# EAGLE design war-in (EAGLE 6.6.0)
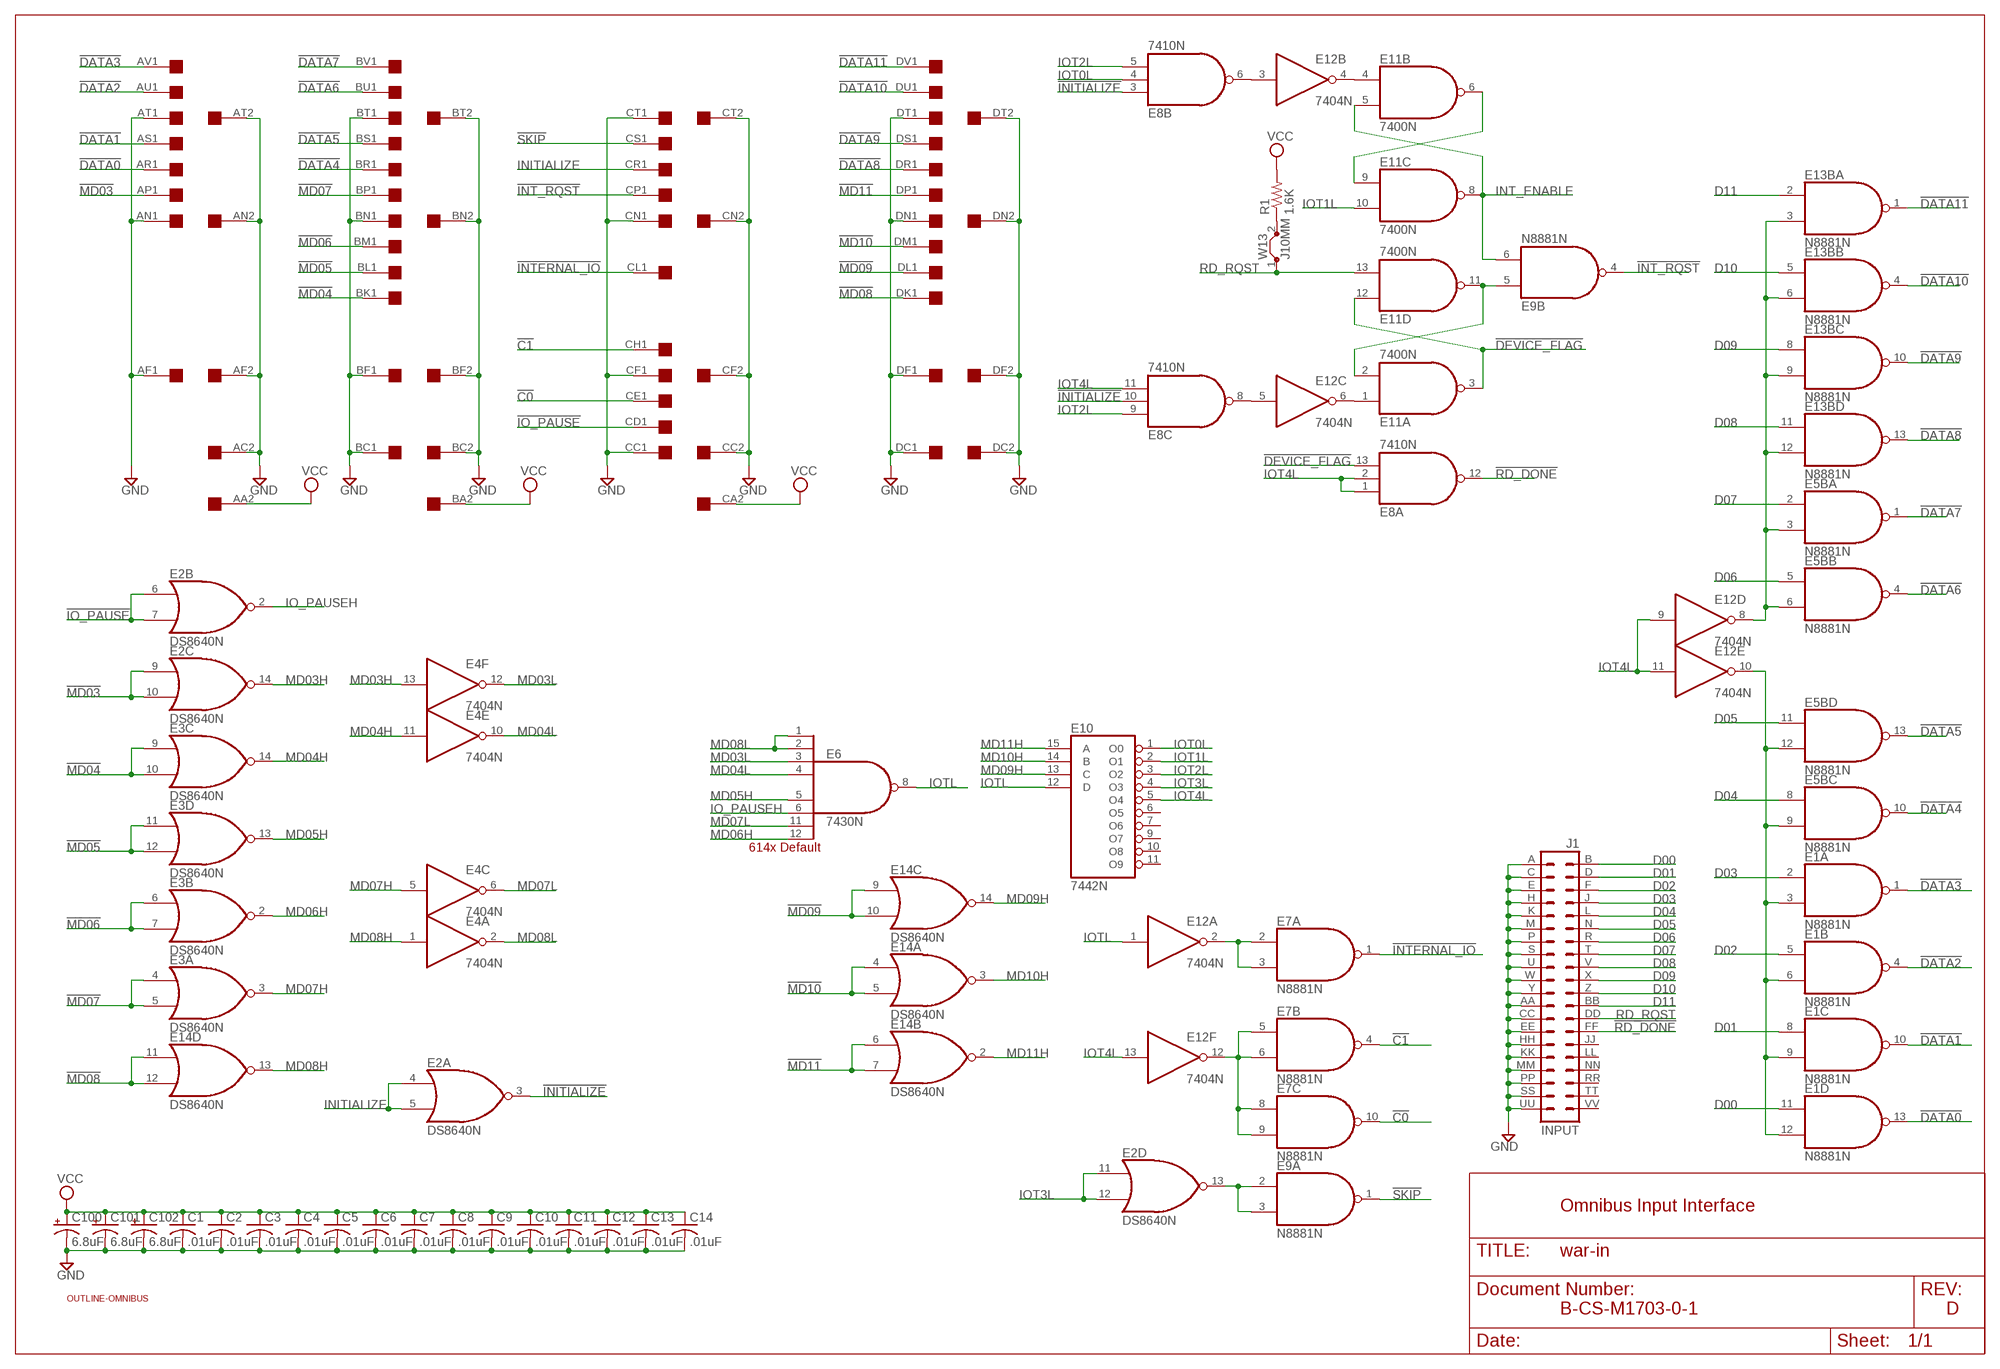
[diagram p0: schematic, sheet 1]

## Parts
C1  .01uF  C-US075-032X103  [C075-032X103]
C2  .01uF  C-US075-032X103  [C075-032X103]
C3  .01uF  C-US075-032X103  [C075-032X103]
C4  .01uF  C-US075-032X103  [C075-032X103]
C5  .01uF  C-US075-032X103  [C075-032X103]
C6  .01uF  C-US075-032X103  [C075-032X103]
C7  .01uF  C-US075-032X103  [C075-032X103]
C8  .01uF  C-US075-032X103  [C075-032X103]
C9  .01uF  C-US075-032X103  [C075-032X103]
C10  .01uF  C-US075-032X103  [C075-032X103]
C11  .01uF  C-US075-032X103  [C075-032X103]
C12  .01uF  C-US075-032X103  [C075-032X103]
C13  .01uF  C-US075-032X103  [C075-032X103]
C14  .01uF  C-US075-032X103  [C075-032X103]
C100  6.8uF  CPOL-USE20-8AXIAL  [E12-8]
C101  6.8uF  CPOL-USE20-8AXIAL  [E12-8]
C102  6.8uF  CPOL-USE20-8AXIAL  [E12-8]
E1  N8881N  [DIL14]
E2  DS8640N  [DIL14]
E3  DS8640N  [DIL14]
E4  7404N  [DIL14]
E5B  N8881N  [DIL14]
E6  7430N  [DIL14]
E7  N8881N  [DIL14]
E8  7410N  [DIL14]
E9  N8881N  [DIL14]
E10  7442N  74LS42N  [DIL16]
E11  7400N  [DIL14]
E12  7404N  [DIL14]
E13B  N8881N  [DIL14]
E14  DS8640N  [DIL14]
J1  INPUT  DEC40PINH  [DEC40PINH]
R1  1.6K  R-US_0207/10  [0207/10]
U$2  QUAD  [EDGE-CON8]
U$4  OUTLINE-OMNIBUS  [OMNIBUS]
W13  J10MM  [10]

## Nets
!C0: E7.10(C:O) U$2.CE1
!C1: E7.4(B:O) U$2.CH1
!DATA0: E1.13(D:O) U$2.AR1
!DATA1: E1.10(C:O) U$2.AS1
!DATA2: E1.4(B:O) U$2.AU1
!DATA3: E1.1(A:O) U$2.AV1
!DATA4: E5B.10(C:O) U$2.BR1
!DATA5: E5B.13(D:O) U$2.BS1
!DATA6: E5B.4(B:O) U$2.BU1
!DATA7: E5B.1(A:O) U$2.BV1
!DATA8: E13B.13(D:O) U$2.DR1
!DATA9: E13B.10(C:O) U$2.DS1
!DATA10: E13B.4(B:O) U$2.DU1
!DATA11: E13B.1(A:O) U$2.DV1
!DEVICE_FLAG: E8.13(A:I2) E11.3(A:O) E11.12(D:I0)
!INITIALIZE: E2.3(A:O) E8.3(B:I0) E8.10(C:I1)
!INT_ENABLE: E11.6(B:O) E11.9(C:I0)
!INT_RQST: E9.4(B:O) U$2.CP1
!INTERNAL_IO: E7.1(A:O) U$2.CL1
!IO_PAUSE: E2.6(B:I0) E2.7(B:I1) U$2.CD1
!MD03: E2.9(C:I0) E2.10(C:I1) U$2.AP1
!MD04: E3.9(C:I0) E3.10(C:I1) U$2.BK1
!MD05: E3.11(D:I0) E3.12(D:I1) U$2.BL1
!MD06: E3.6(B:I0) E3.7(B:I1) U$2.BM1
!MD07: E3.4(A:I0) E3.5(A:I1) U$2.BP1
!MD08: E14.11(D:I0) E14.12(D:I1) U$2.DK1
!MD09: E14.9(C:I0) E14.10(C:I1) U$2.DL1
!MD10: E14.4(A:I0) E14.5(A:I1) U$2.DM1
!MD11: E14.6(B:I0) E14.7(B:I1) U$2.DP1
!RD_DONE: E8.12(A:O) J1.FF
!SKIP: E9.1(A:O) U$2.CS1
D00: E1.11(D:I0) J1.B
D01: E1.8(C:I0) J1.D
D02: E1.5(B:I0) J1.F
D03: E1.2(A:I0) J1.J
D04: E5B.8(C:I0) J1.L
D05: E5B.11(D:I0) J1.N
D06: E5B.5(B:I0) J1.R
D07: E5B.2(A:I0) J1.T
D08: E13B.11(D:I0) J1.V
D09: E13B.8(C:I0) J1.X
D10: E13B.5(B:I0) J1.Z
D11: E13B.2(A:I0) J1.BB
DEVICE_FLAG: E9.5(B:I0) E11.2(A:I1) E11.11(D:O)
GND [Supply]: C1.2 C2.2 C3.2 C4.2 C5.2 C6.2 C7.2 C8.2 C9.2 C10.2 C11.2 C12.2 C13.2 C14.2 C100.- C101.- C102.- J1.A J1.AA J1.C J1.CC J1.E J1.EE J1.H J1.HH J1.K J1.KK J1.M J1.MM J1.P J1.PP J1.S J1.SS J1.U J1.UU J1.W J1.Y U$2.AC2 U$2.AF1 U$2.AF2 U$2.AN1 U$2.AN2 U$2.AT1 U$2.AT2 U$2.BC1 U$2.BC2 U$2.BF1 U$2.BF2 U$2.BN1 U$2.BN2 U$2.BT1 U$2.BT2 U$2.CC1 U$2.CC2 U$2.CF1 U$2.CF2 U$2.CN1 U$2.CN2 U$2.CT1 U$2.CT2 U$2.DC1 U$2.DC2 U$2.DF1 U$2.DF2 U$2.DN1 U$2.DN2 U$2.DT1 U$2.DT2
INITIALIZE: E2.4(A:I0) E2.5(A:I1) U$2.CR1
INT_ENABLE: E9.6(B:I1) E11.5(B:I1) E11.8(C:O)
IO_PAUSEH: E2.2(B:O) E6.6(I5)
IOT0L: E8.4(B:I1) E10.1(O0)
IOT1L: E10.2(O1) E11.10(C:I1)
IOT2L: E8.5(B:I2) E8.9(C:I0) E10.3(O2)
IOT3L: E2.11(D:I0) E2.12(D:I1) E10.4(O3)
IOT4L: E8.1(A:I0) E8.2(A:I1) E8.11(C:I2) E10.5(O4) E12.9(D:I) E12.11(E:I) E12.13(F:I)
IOTL: E6.8(O) E10.12(D) E12.1(A:I)
MD03H: E2.14(C:O) E4.13(F:I)
MD03L: E4.12(F:O) E6.3(I2)
MD04H: E3.14(C:O) E4.11(E:I)
MD04L: E4.10(E:O) E6.4(I3)
MD05H: E3.13(D:O) E6.5(I4)
MD06H: E3.2(B:O) E6.12(I7)
MD07H: E3.3(A:O) E4.5(C:I)
MD07L: E4.6(C:O) E6.11(I6)
MD08H: E4.1(A:I) E14.13(D:O)
MD08L: E4.2(A:O) E6.1(I0) E6.2(I1)
MD09H: E10.13(C) E14.14(C:O)
MD10H: E10.14(B) E14.3(A:O)
MD11H: E10.15(A) E14.2(B:O)
N$1: E1.3(A:I1) E1.6(B:I1) E1.9(C:I1) E1.12(D:I1) E5B.9(C:I1) E5B.12(D:I1) E12.10(E:O)
N$2: R1.1 W13.2
N$3: E5B.3(A:I1) E5B.6(B:I1) E12.8(D:O) E13B.3(A:I1) E13B.6(B:I1) E13B.9(C:I1) E13B.12(D:I1)
N$8: E11.4(B:I0) E12.4(B:O)
N$10: E2.13(D:O) E9.2(A:I0) E9.3(A:I1)
N$13: E8.6(B:O) E12.3(B:I)
N$24: E11.1(A:I0) E12.6(C:O)
N$26: E8.8(C:O) E12.5(C:I)
N$196: E7.2(A:I0) E7.3(A:I1) E12.2(A:O)
N$337: E7.5(B:I0) E7.6(B:I1) E7.8(C:I0) E7.9(C:I1) E12.12(F:O)
RD_RQST: E11.13(D:I1) J1.DD W13.1
VCC [Supply]: C1.1 C2.1 C3.1 C4.1 C5.1 C6.1 C7.1 C8.1 C9.1 C10.1 C11.1 C12.1 C13.1 C14.1 C100.+ C101.+ C102.+ R1.2 U$2.AA2 U$2.BA2 U$2.CA2
Unconnected: E4.3(B:I) E4.4(B:O) E4.8(D:O) E4.9(D:I) E7.11(D:I0) E7.12(D:I1) E7.13(D:O) E9.8(C:I0) E9.9(C:I1) E9.10(C:O) E9.11(D:I0) E9.12(D:I1) E9.13(D:O) E10.6(O5) E10.7(O6) E10.9(O7) E10.10(O8) E10.11(O9) J1.JJ J1.LL J1.NN J1.RR J1.TT J1.VV U$2.AA1 U$2.AB1 U$2.AB2 U$2.AC1 U$2.AD1 U$2.AD2 U$2.AE1 U$2.AE2 U$2.AH1 U$2.AH2 U$2.AJ1 U$2.AJ2 U$2.AK1 U$2.AK2 U$2.AL1 U$2.AL2 U$2.AM1 U$2.AM2 U$2.AP2 U$2.AR2 U$2.AS2 U$2.AU2 U$2.AV2 U$2.BA1 U$2.BB1 U$2.BB2 U$2.BD1 U$2.BD2 U$2.BE1 U$2.BE2 U$2.BH1 U$2.BH2 U$2.BJ1 U$2.BJ2 U$2.BK2 U$2.BL2 U$2.BM2 U$2.BP2 U$2.BR2 U$2.BS2 U$2.BU2 U$2.BV2 U$2.CA1 U$2.CB1 U$2.CB2 U$2.CD2 U$2.CE2 U$2.CH2 U$2.CJ1 U$2.CJ2 U$2.CK1 U$2.CK2 U$2.CL2 U$2.CM1 U$2.CM2 U$2.CP2 U$2.CR2 U$2.CS2 U$2.CU1 U$2.CU2 U$2.CV1 U$2.CV2 U$2.DA1 U$2.DA2 U$2.DB1 U$2.DB2 U$2.DD1 U$2.DD2 U$2.DE1 U$2.DE2 U$2.DH1 U$2.DH2 U$2.DJ1 U$2.DJ2 U$2.DK2 U$2.DL2 U$2.DM2 U$2.DP2 U$2.DR2 U$2.DS2 U$2.DU2 U$2.DV2

## Notes on the sheet
- 614x Default
- Omnibus Input Interface
- B-CS-M1703-0-1 | D

## Power pins joined to a net without a drawn wire
GND: E1.7(P:GND) E2.1(P:GND) E3.1(P:GND) E4.7(P:GND) E5B.7(P:GND) E6.7(GND) E7.7(P:GND) E8.7(P:GND) E9.7(P:GND) E10.8(GND) E11.7(P:GND) E12.7(P:GND) E13B.7(P:GND) E14.1(P:GND)
VCC: E1.14(P:VCC) E2.8(P:VCC) E3.8(P:VCC) E4.14(P:VCC) E5B.14(P:VCC) E6.14(VCC) E7.14(P:VCC) E8.14(P:VCC) E9.14(P:VCC) E10.16(VCC) E11.14(P:VCC) E12.14(P:VCC) E13B.14(P:VCC) E14.8(P:VCC)

## Library data of the parts
C1-C14 = rcl:C-US: CAPACITOR, American symbol
C100-C102 = dec-con:CPOL-USE20-8AXIAL: A 0.8 inch electrolytic.
E1 E5B E7 E9 E13B = dec-con:N8881: Quad 2-input NAND gate, open collector
E2 E3 E14 = dec-con:DS8640: Quad NOR gate
E4 E12 = 74xx-us:74*04: Hex INVERTER
E6 = 74xx-us:74*30: 8-input NAND gate
E8 = 74xx-us:74*10: Triple 3-input NAND gate
E10 = 74xx-us:74*42: 4-line to 10-line DECODER (1-of-10)
E11 = 74xx-us:74*00: Quad 2-input NAND gate
J1 = dec-con:DEC40PIN: PIN HEADER
R1 = rcl:R-US_: RESISTOR, American symbol
U$2 = dec-con:QUAD: Quad-Height DEC board
U$4 = dec-con:OUTLINE-*: Board outlines for DEC boards.
W13 = jumper:J: Bridge

## Net classes
1 Supply: width 0.813 mm

## Board
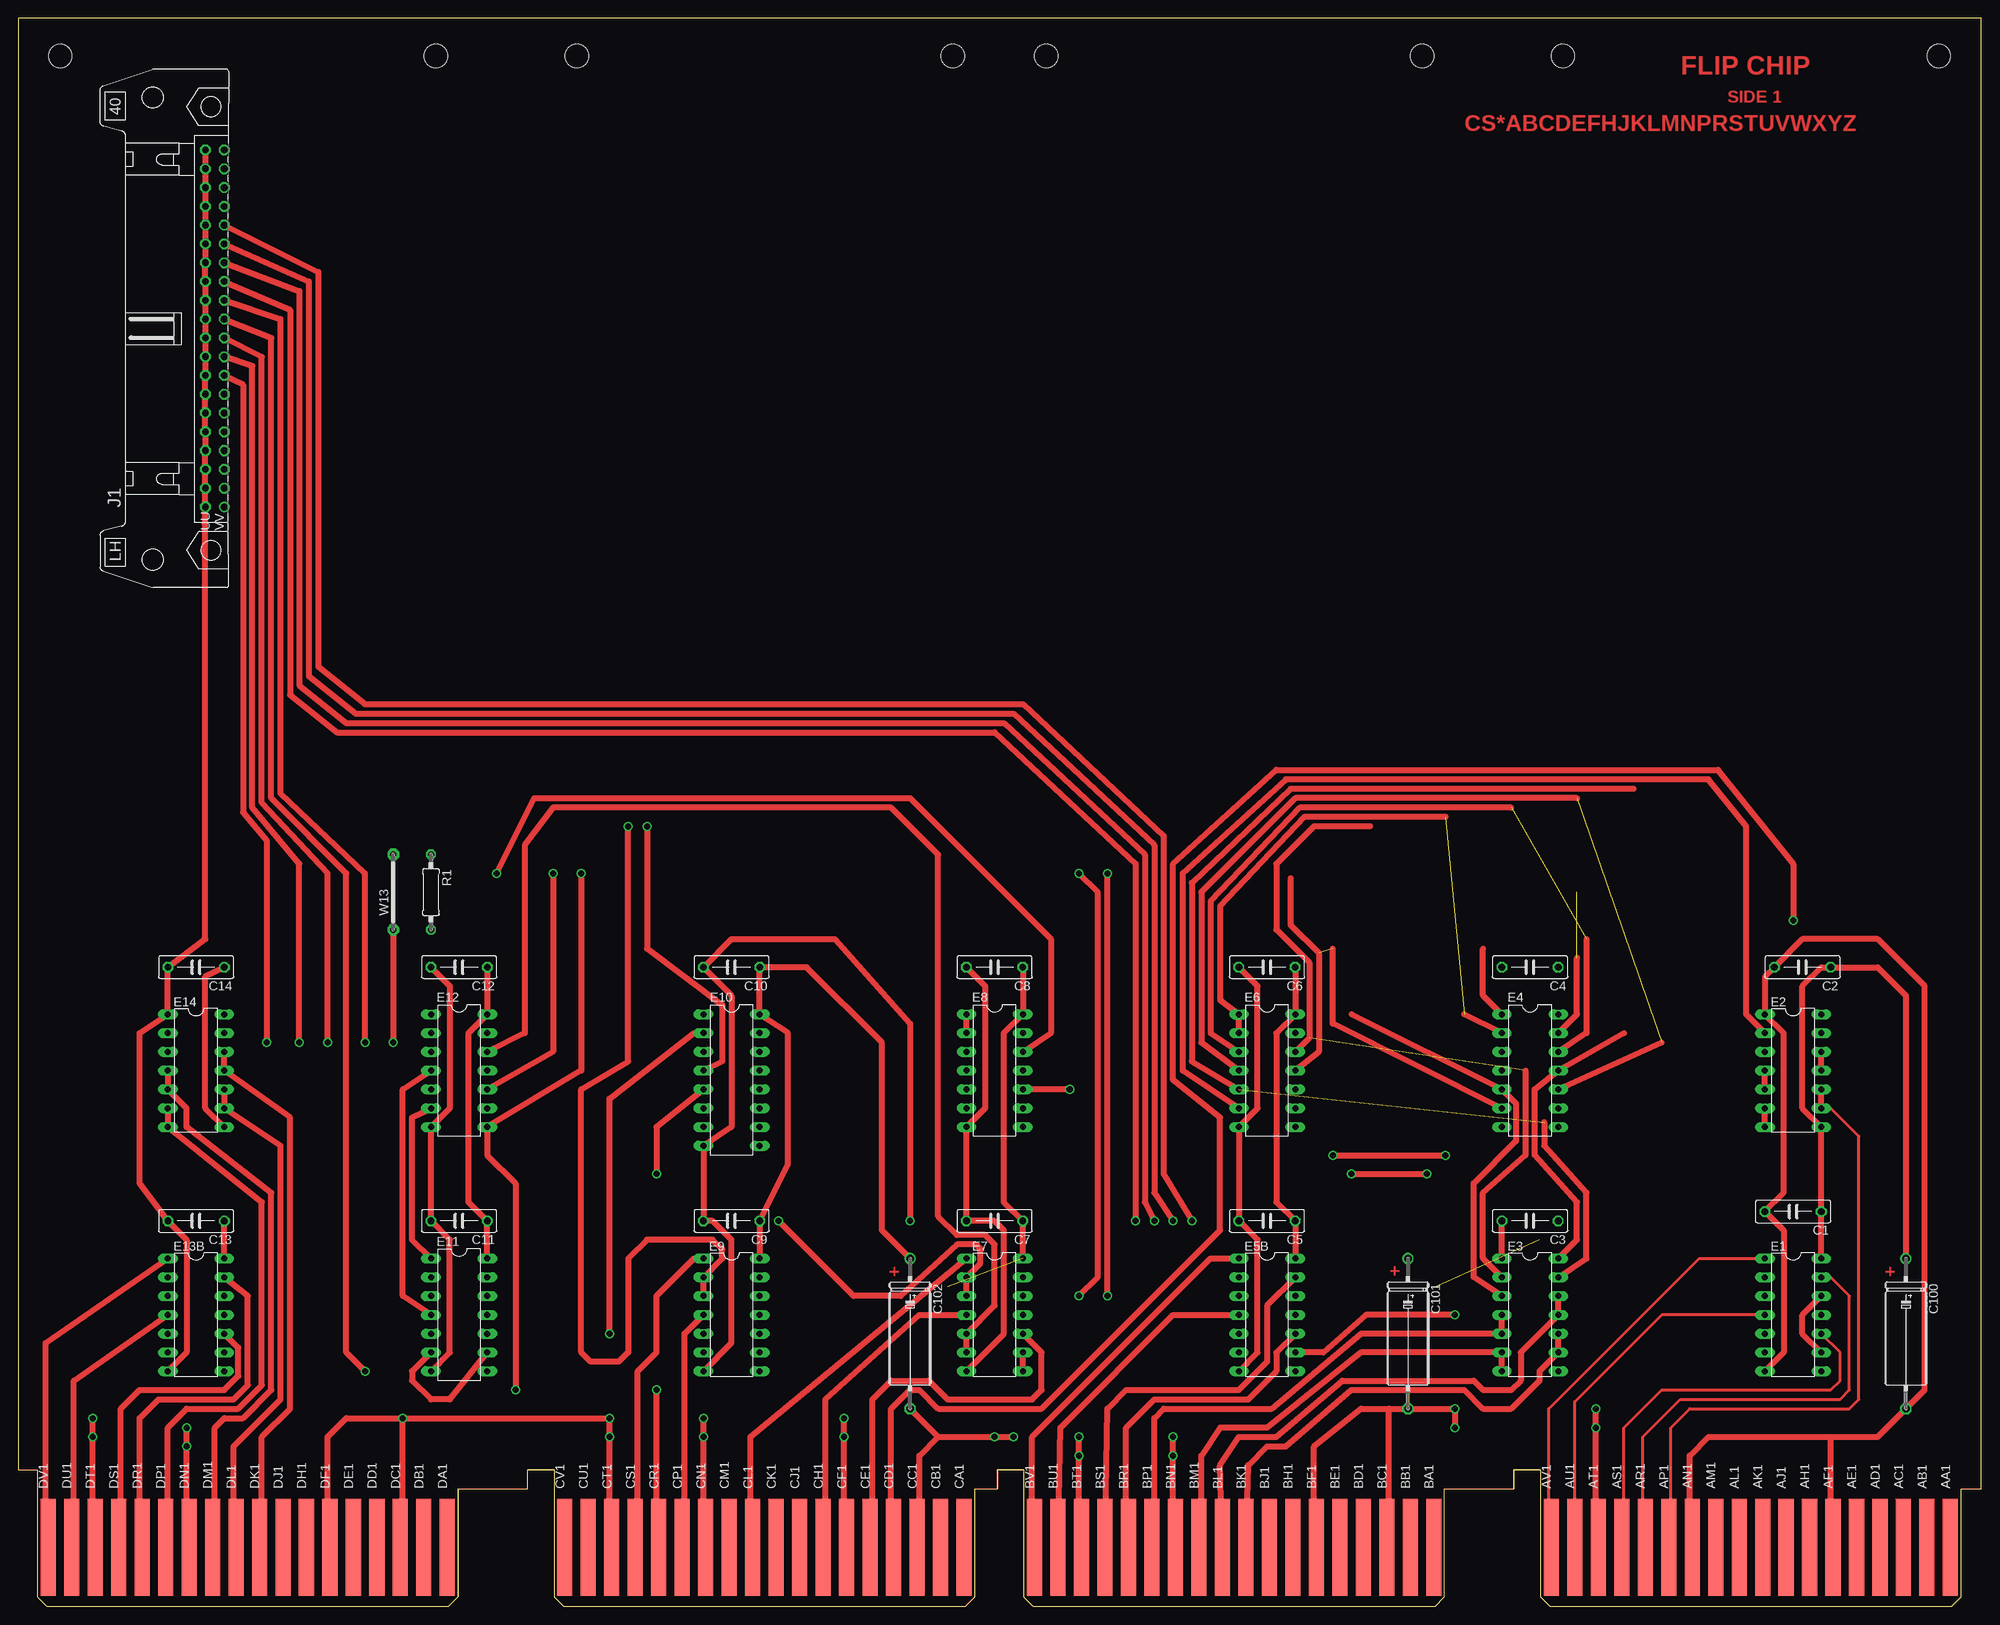
[diagram p1: board, top side]
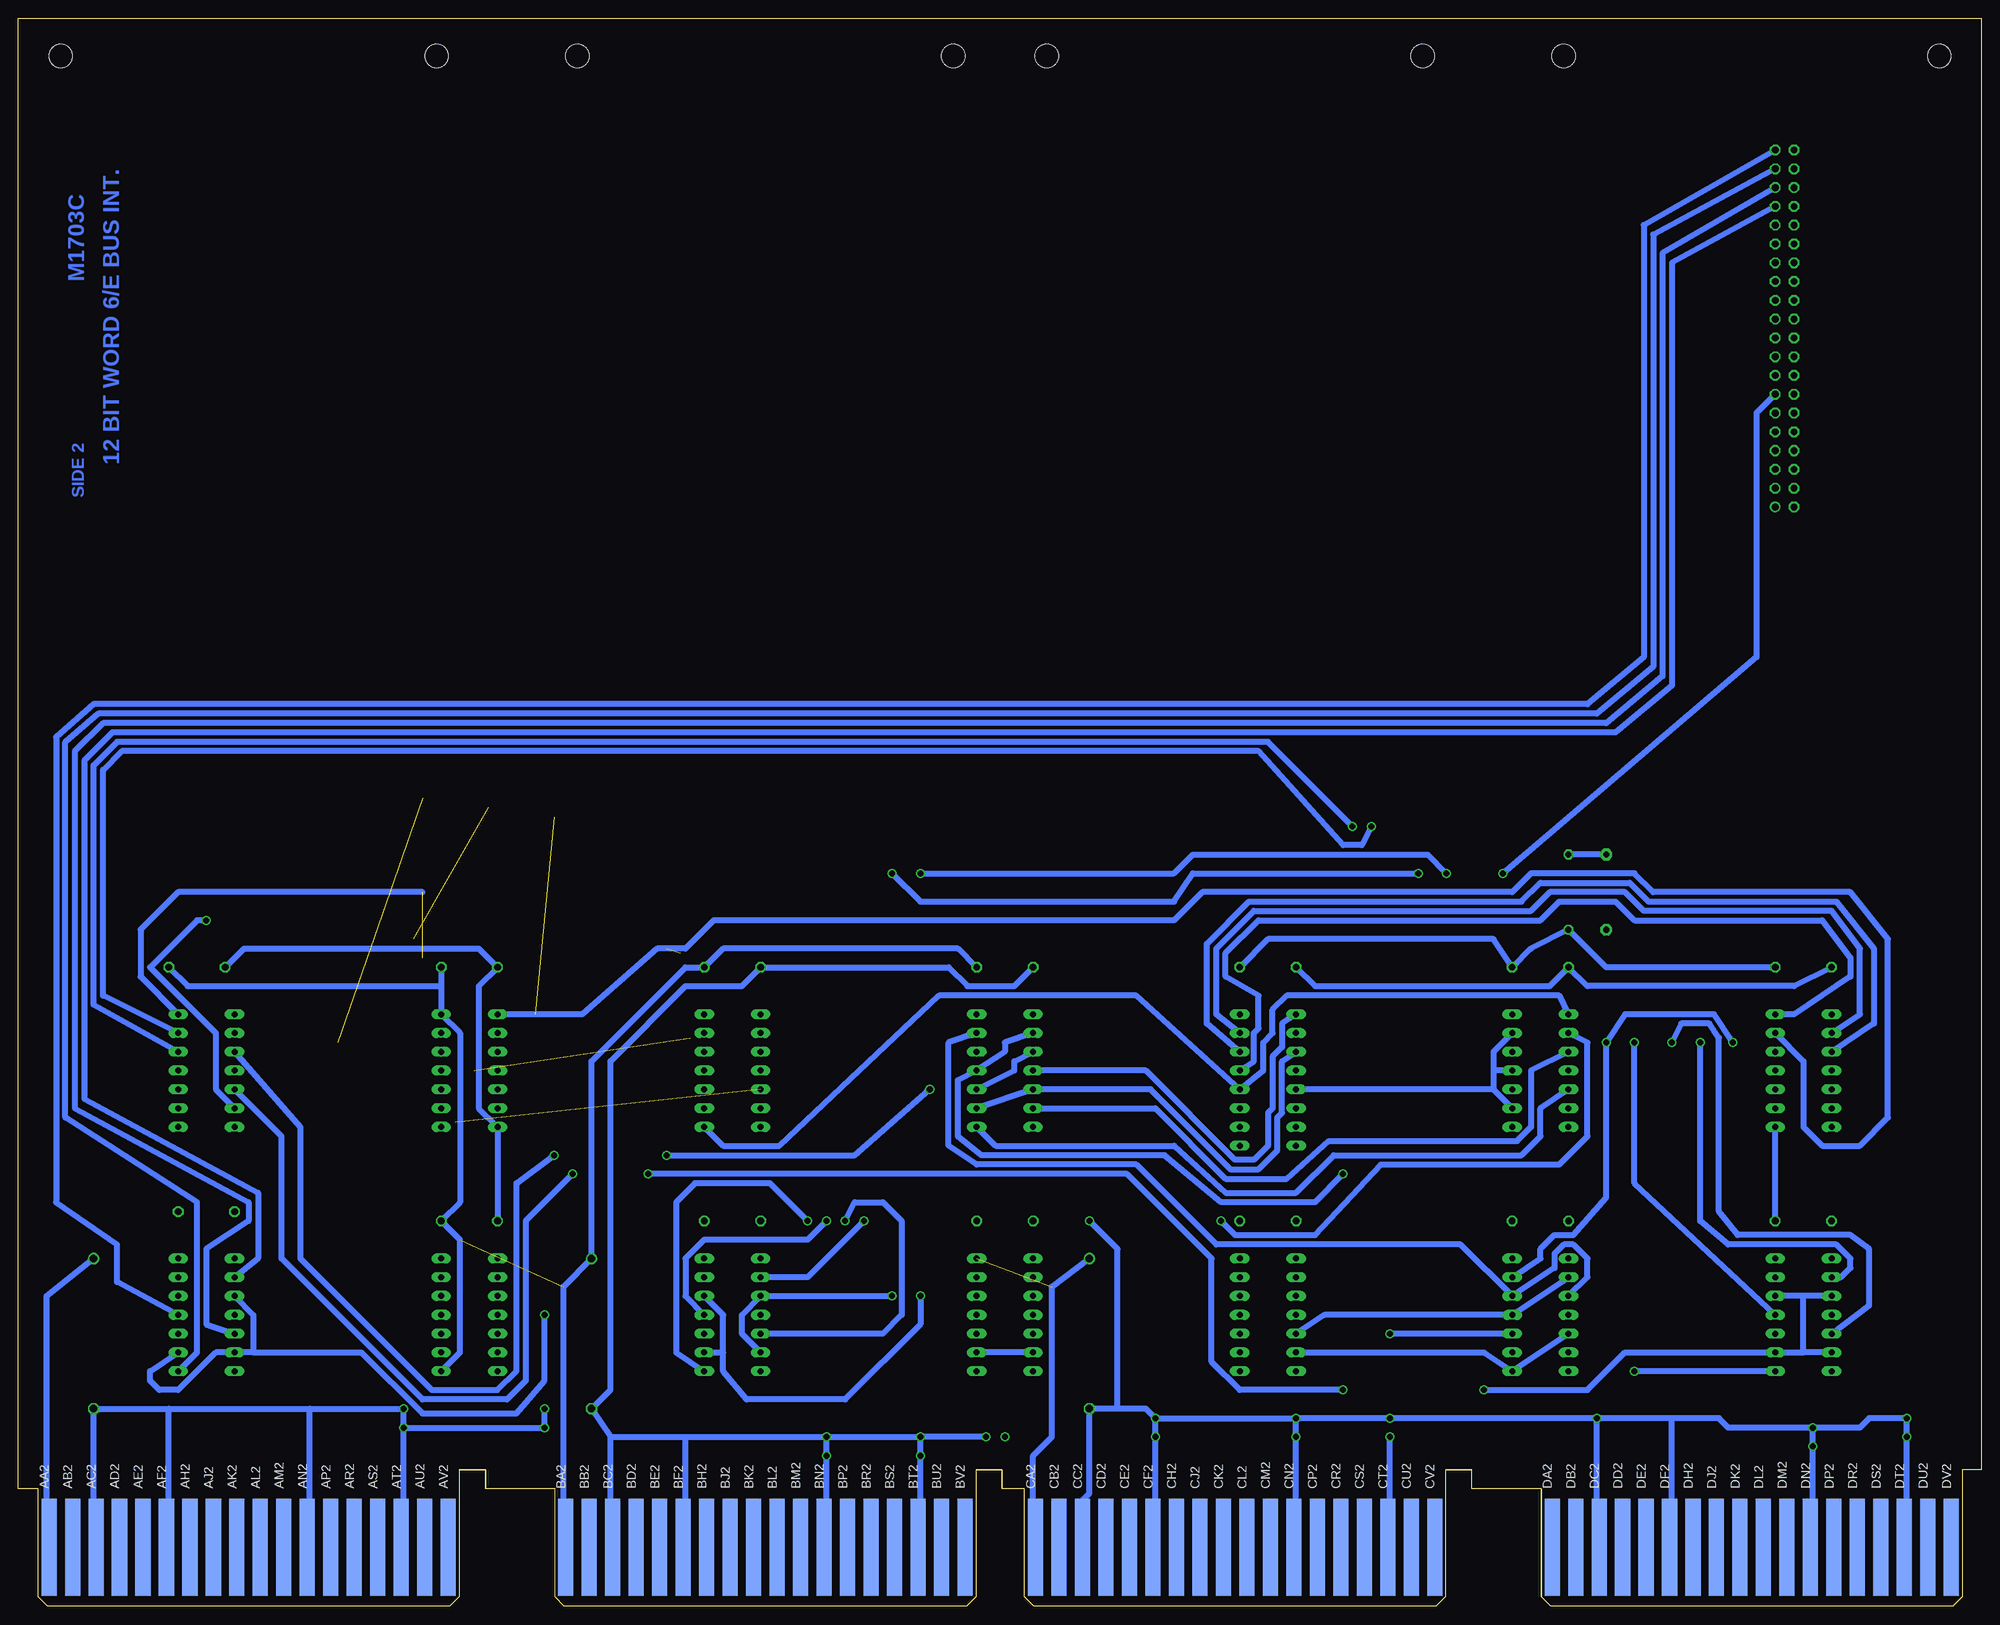
[diagram p2: board, bottom side, seen from below]

Size 265.3 x 214.63 mm. Coordinates in mm from the lower left corner, seen from the top.
Copper layers (1+16): Top 0.035mm / dielectric 1.5mm / Bottom 0.035mm
Design rules "16mils": minimum track width 16mil, minimum drill 32mil, track to track 15mil, track to pad 10mil, pad to pad 10mil, via to via 10mil, smd to smd 10mil, copper to edge 13mil, drill to drill 10mil, minimum pad ring 10mil, minimum via ring 8mil, stop-mask expansion 0mil, vias tented up to drill 0mil, thermal gap 10mil

### Footprints (pad centres in the part's own frame; a part is rotated, then mirrored left to right if it is on the bottom)
C075-032X103 = drill 0.914 octagon: 1 -3.81,0; 2 3.81,0
E12-8 = drill 1.016: + -10.16,0 | drill 1.016 octagon: - 10.16,0
DIL14 = drill 0.813 long: 1 -7.62,-3.81; 2 -5.08,-3.81; 3 -2.54,-3.81; 4 0,-3.81; 5 2.54,-3.81; 6 5.08,-3.81; 7 7.62,-3.81; 8 7.62,3.81; 9 5.08,3.81; 10 2.54,3.81; 11 0,3.81; 12 -2.54,3.81; 13 -5.08,3.81; 14 -7.62,3.81
DIL16 = drill 0.813 long: 1 -8.89,-3.81; 2 -6.35,-3.81; 3 -3.81,-3.81; 4 -1.27,-3.81; 5 1.27,-3.81; 6 3.81,-3.81; 7 6.35,-3.81; 8 8.89,-3.81; 9 8.89,3.81; 10 6.35,3.81; 11 3.81,3.81; 12 1.27,3.81; 13 -1.27,3.81; 14 -3.81,3.81; 15 -6.35,3.81; 16 -8.89,3.81
DEC40PINH = drill 0.914 octagon: A 24.13,1.27; AA -3.81,1.27; B 24.13,-1.27; BB -3.81,-1.27; C 21.59,1.27; CC -6.35,1.27; D 21.59,-1.27; DD -6.35,-1.27; E 19.05,1.27; EE -8.89,1.27; F 19.05,-1.27; FF -8.89,-1.27; H 16.51,1.27; HH -11.43,1.27; J 16.51,-1.27; JJ -11.43,-1.27; K 13.97,1.27; KK -13.97,1.27; L 13.97,-1.27; LL -13.97,-1.27; M 11.43,1.27; MM -16.51,1.27; N 11.43,-1.27; NN -16.51,-1.27; P 8.89,1.27; PP -19.05,1.27; R 8.89,-1.27; RR -19.05,-1.27; S 6.35,1.27; SS -21.59,1.27; T 6.35,-1.27; TT -21.59,-1.27; U 3.81,1.27; UU -24.13,1.27; V 3.81,-1.27; W 1.27,1.27; X 1.27,-1.27; Y -1.27,1.27; Z -1.27,-1.27 | drill 0.914: VV -24.13,-1.27
0207/10 = drill 0.813 octagon: 1 -5.08,0; 2 5.08,0
EDGE-CON8 = smd 2.032 x 13.106: AA1 261.303,7.938; AB1 258.127,7.938; AC1 254.952,7.938; AD1 251.778,7.938; AE1 248.602,7.938; AF1 245.428,7.938; AH1 242.252,7.938; AJ1 239.077,7.938; AK1 235.903,7.938; AL1 232.727,7.938; AM1 229.553,7.938; AN1 226.377,7.938; AP1 223.202,7.938; AR1 220.028,7.938; AS1 216.852,7.938; AT1 213.678,7.938; AU1 210.502,7.938; AV1 207.327,7.938; BA1 191.452,7.938; BB1 188.278,7.938; BC1 185.102,7.938; BD1 181.928,7.938; BE1 178.752,7.938; BF1 175.577,7.938; BH1 172.403,7.938; BJ1 169.227,7.938; BK1 166.053,7.938; BL1 162.877,7.938; BM1 159.702,7.938; BN1 156.528,7.938; BP1 153.352,7.938; BR1 150.178,7.938; BS1 147.002,7.938; BT1 143.827,7.938; BU1 140.653,7.938; BV1 137.477,7.938; CA1 127.953,7.938; CB1 124.778,7.938; CC1 121.603,7.938; CD1 118.427,7.938; CE1 115.252,7.938; CF1 112.078,7.938; CH1 108.903,7.938; CJ1 105.728,7.938; CK1 102.552,7.938; CL1 99.377,7.938; CM1 96.203,7.938; CN1 93.028,7.938; CP1 89.853,7.938; CR1 86.677,7.938; CS1 83.502,7.938; CT1 80.328,7.938; CU1 77.153,7.938; CV1 73.978,7.938; DA1 58.102,7.938; DB1 54.928,7.938; DC1 51.752,7.938; DD1 48.578,7.938; DE1 45.403,7.938; DF1 42.227,7.938; DH1 39.053,7.938; DJ1 35.877,7.938; DK1 32.703,7.938; DL1 29.527,7.938; DM1 26.352,7.938; DN1 23.177,7.938; DP1 20.003,7.938; DR1 16.828,7.938; DS1 13.652,7.938; DT1 10.477,7.938; DU1 7.303,7.938; DV1 4.128,7.938 | smd 2.032 x 13.106 bottom: AA2 261.303,7.938; AB2 258.127,7.938; AC2 254.952,7.938; AD2 251.778,7.938; AE2 248.602,7.938; AF2 245.428,7.938; AH2 242.252,7.938; AJ2 239.077,7.938; AK2 235.903,7.938; AL2 232.727,7.938; AM2 229.553,7.938; AN2 226.377,7.938; AP2 223.202,7.938; AR2 220.028,7.938; AS2 216.852,7.938; AT2 213.678,7.938; AU2 210.502,7.938; AV2 207.327,7.938; BA2 191.452,7.938; BB2 188.278,7.938; BC2 185.102,7.938; BD2 181.928,7.938; BE2 178.752,7.938; BF2 175.577,7.938; BH2 172.403,7.938; BJ2 169.227,7.938; BK2 166.053,7.938; BL2 162.877,7.938; BM2 159.702,7.938; BN2 156.528,7.938; BP2 153.352,7.938; BR2 150.178,7.938; BS2 147.002,7.938; BT2 143.827,7.938; BU2 140.653,7.938; BV2 137.477,7.938; CA2 127.953,7.938; CB2 124.778,7.938; CC2 121.603,7.938; CD2 118.427,7.938; CE2 115.252,7.938; CF2 112.078,7.938; CH2 108.903,7.938; CJ2 105.728,7.938; CK2 102.552,7.938; CL2 99.377,7.938; CM2 96.203,7.938; CN2 93.028,7.938; CP2 89.853,7.938; CR2 86.677,7.938; CS2 83.502,7.938; CT2 80.328,7.938; CU2 77.153,7.938; CV2 73.978,7.938; DA2 58.102,7.938; DB2 54.928,7.938; DC2 51.752,7.938; DD2 48.578,7.938; DE2 45.403,7.938; DF2 42.227,7.938; DH2 39.053,7.938; DJ2 35.877,7.938; DK2 32.703,7.938; DL2 29.527,7.938; DM2 26.352,7.938; DN2 23.177,7.938; DP2 20.003,7.938; DR2 16.828,7.938; DS2 13.652,7.938; DT2 10.477,7.938; DU2 7.303,7.938; DV2 4.128,7.938
OMNIBUS = hole 3.175: 208.915,209.55; 259.715,209.55; 189.865,209.55; 139.065,209.55; 75.616,209.55; 126.416,209.55; 56.566,209.55; 5.766,209.55
10 = drill 0.813 pad 1.6 octagon: 1 -5.08,0; 2 5.08,0

### Placement (x,y rotation side)
C1  239.9,53.34 180 top
C2  241.17,86.36 180 top
C3  204.34,52.07 180 top
C4  204.34,86.36 180 top
C5  168.78,52.07 180 top
C6  168.78,86.36 180 top
C7  131.95,52.07 180 top
C8  131.95,86.36 180 top
C9  96.39,52.07 180 top
C10  96.39,86.36 180 top
C11  59.56,52.07 180 top
C12  59.56,86.36 180 top
C13  24,52.07 180 top
C14  24,86.36 180 top
C100  255.14,36.83 270 top
C101  187.83,36.83 270 top
C102  120.52,36.83 270 top
E1  239.9,39.37 270 top
E2  239.9,72.39 270 top
E3  204.34,39.37 270 top
E4  204.34,72.39 270 top
E5B  168.78,39.37 270 top
E6  168.78,72.39 270 top
E7  131.95,39.37 270 top
E8  131.95,72.39 270 top
E9  96.39,39.37 270 top
E10  96.39,71.12 270 top
E11  59.56,39.37 270 top
E12  59.56,72.39 270 top
E13B  24,39.37 270 top
E14  24,72.39 270 top
J1  26.54,172.72 90 top
R1  55.75,96.52 270 top
U$2  -0.13,0 0 top
U$3  [FLIPCHIP]  205.61,212.09 270 top
U$4  -0.13,0 0 top
W13  50.67,96.52 90 top

### Tracks (layer width: path | path; a pad name or v marks a point on that pad's centre or on a via)
!C0
  Top 0.813: U$2.CE1 115.44,11.43 115.44,27.94 117.98,30.48 123.06,30.48 125.6,27.94 137.03,27.94 138.3,29.21 138.3,34.29 E7.10
!C1
  Top 0.813: U$2.CH1 109.09,10.16 109.09,27.94 121.79,39.37 E7.4
!DATA0
  Top 0.406: U$2.AR1 219.58,8.26 219.58,22.86 224.66,27.94 246.25,27.94 247.52,29.21 247.52,41.91 244.98,44.45 E1.13
!DATA1
  Top 0.406: U$2.AS1 217.04,8.26 217.04,24.13 222.12,29.21 244.98,29.21 246.25,30.48 246.25,34.29 E1.10
!DATA2
  Top 0.406: E1.4 222.12,39.37 210.38,27.62 U$2.AU1
!DATA3
  Top 0.406: U$2.AV1 206.88,7.94 206.88,26.67 227.2,46.99 E1.1
!DATA4
  Top 0.813: U$2.BR1 149.73,8.26 149.73,24.13 153.54,27.94 166.24,27.94 170.05,31.75 170.05,34.29 E5B.10
!DATA5
  Top 0.813: U$2.BS1 147.19,26.67 149.73,29.21 164.97,29.21 168.78,33.02 168.78,40.64 E5B.13
!DATA6
  Top 0.813: U$2.BU1 140.84,24.13 156.08,39.37 E5B.4
!DATA7
  Top 0.813: U$2.BV1 137.03,8.89 137.03,22.86 161.16,46.99 E5B.1
!DATA8
  Top 0.813: U$2.DR1 16.38,8.89 16.38,25.4 18.92,27.94 29.08,27.94 30.99,29.84 30.99,41.91 E13B.13
!DATA9
  Top 0.813: U$2.DS1 13.84,7.62 13.84,26.67 16.38,29.21 27.81,29.21 29.72,31.11 29.72,34.92 E13B.10
!DATA10
  Top 0.813: U$2.DU1 7.49,7.62 7.49,30.48 E13B.4
!DATA11
  Top 0.813: U$2.DV1 4,6.67 3.68,6.35 3.68,35.56 E13B.1
!DEVICE_FLAG
  Bottom 0.813: E11.3 53.21,44.45 53.21,46.99 55.12,48.9 56.39,48.9 57.66,47.62 57.66,45.72 E11.12 70.36,48.9 103.38,48.9 114.17,59.69 135.76,59.69 139.57,62.23 139.57,76.2 E8.13
!INITIALIZE  (via drill 0.81)
  Top 0.813: v177.67,60.96 v192.91,60.96 | v142.11,69.85 E8.10
  Bottom 0.813: v192.91,60.96 197.99,57.15 197.99,31.75 200.53,29.21 209.42,29.21 227.2,46.99 227.2,64.77 E2.3 | v177.67,60.96 152.27,60.96 v142.11,69.85 | E8.10 130.68,72.39 130.68,73.66 E8.3
!INT_ENABLE
  Top 0.813: E11.6 53.21,31.75 53.21,30.48 55.75,27.94 58.29,27.94 E11.9
!INT_RQST
  Top 0.813: U$2.CP1 90.04,8.26 90.04,36.83 E9.4
!INTERNAL_IO
  Top 0.813: U$2.CL1 98.93,8.89 98.93,22.86 E7.1
!IO_PAUSE  (via drill 0.81)
  Top 0.813: U$2.CD1 117.98,8.26 117.98,26.67 120.52,29.21 121.79,29.21 124.33,26.67 138.3,26.67 162.43,50.8 162.43,66.04 156.08,71.12 156.08,100.33 170.05,113.03 229.74,113.03 239.9,100.33 v239.9,92.71 | E2.7 E2.6
  Bottom 0.813: v239.9,92.71 241.17,92.71 247.52,86.36 238.63,77.47 238.63,69.85 E2.6
!MD03
  Top 0.406: U$2.AP1 223.39,8.26 223.39,24.13 225.93,26.67 247.52,26.67 248.79,27.94 248.79,63.5 244.98,67.31 E2.9
  Top 0.813: E2.9 E2.10
!MD04
  Top 0.813: U$2.BK1 166.24,19.05 168.78,21.59 171.32,21.59 180.21,29.21 195.45,29.21 197.99,26.67 201.8,26.67 205.61,30.48 205.61,31.75 E3.9 E3.10
!MD05
  Top 0.813: U$2.BL1 162.43,19.05 164.97,22.86 170.05,22.86 178.94,30.48 196.72,30.48 197.99,29.21 201.8,29.21 203.07,30.48 203.07,34.29 E3.11 E3.12
!MD06
  Top 0.813: U$2.BM1 159.89,7.62 159.89,20.32 162.43,24.13 168.78,24.13 181.48,34.29 E3.6 E3.7
!MD07
  Top 0.813: U$2.BP1 153.54,8.89 153.54,25.4 154.81,26.67 169.42,26.67 181.48,36.83 E3.5 E3.4
!MD08
  Top 0.813: U$2.DK1 32.89,8.89 32.89,22.86 36.7,26.67 36.7,66.04 E14.11 E14.12
!MD09
  Top 0.813: E14.10 E14.9 35.43,62.23 35.43,27.94 29.08,21.59 29.08,7.62 U$2.DL1
!MD10
  Top 0.813: E14.4 E14.5 22.73,67.31 22.73,64.77 34.16,55.88 34.16,29.21 30.35,25.4 27.81,25.4 26.54,24.13 26.54,8.89 U$2.DM1
!MD11
  Top 0.813: U$2.DP1 20.19,8.89 20.19,24.13 22.73,26.67 29.72,26.67 32.89,29.84 32.89,54.61 E14.7 E14.6
!RD_DONE  (via drill 0.81)
  Top 0.813: v64.64,99.06 69.72,109.22 120.52,109.22 139.57,90.17 139.57,77.47 E8.12
  Bottom 0.813: J1.FF 30.35,161.29 30.35,128.27 v64.64,99.06
!SKIP
  Top 0.813: U$2.CS1 83.69,8.26 83.69,31.75 86.23,34.29 86.23,41.91 91.31,46.99 E9.1
D00
  Bottom 0.813: J1.B 45.59,186.69 45.59,128.27 53.21,121.92 255.14,121.92 260.22,117.47 260.22,54.61 251.97,48.9 251.97,43.81 E1.11
D01
  Bottom 0.813: E1.8 241.17,34.29 241.17,54.61 258.95,66.04 258.95,116.84 254.51,120.65 51.94,120.65 44.32,127 44.32,185.42 J1.D
D02
  Bottom 0.813: J1.F 43.05,182.88 43.05,125.73 50.67,119.38 253.87,119.38 257.68,115.57 257.68,67.31 234.19,54.61 234.19,52.07 239.9,48.26 239.9,38.1 E1.5
D03
  Bottom 0.813: J1.J 41.78,181.61 41.78,124.46 49.4,118.11 252.6,118.11 256.41,114.3 256.41,68.58 232.92,55.88 232.92,46.99 E1.2
D04  (via drill 0.81)
  Top 0.813: J1.L 40.51,180.34 40.51,127 46.86,121.92 135.76,121.92 154.81,104.14 154.81,58.42 v158.62,52.07
  Bottom 0.813: v158.62,52.07 163.7,57.15 173.86,57.15 176.4,54.61 176.4,34.29 E5B.8
D05  (via drill 0.81)
  Top 0.813: J1.N 39.24,179.07 39.24,125.73 45.59,120.65 134.49,120.65 153.54,102.87 153.54,55.88 v156.08,52.07
  Bottom 0.813: v156.08,52.07 158.62,49.53 172.59,49.53 175.13,46.99 175.13,41.91 E5B.11
D06  (via drill 0.81)
  Top 0.813: J1.R 37.97,177.8 37.97,124.46 44.32,119.38 133.22,119.38 152.27,101.6 152.27,54.61 v153.54,52.07
  Bottom 0.813: v153.54,52.07 152.27,54.61 148.46,54.61 145.92,52.07 145.92,39.37 148.46,36.83 E5B.5
D07  (via drill 0.81)
  Top 0.813: J1.T 36.7,175.26 36.7,123.19 43.05,118.11 131.95,118.11 151,100.33 v151,52.07
  Bottom 0.813: v151,52.07 158.62,44.45 E5B.2
D08  (via drill 0.81)
  Top 0.813: v46.86,76.2 46.86,99.06 35.43,109.86 35.43,173.99 J1.V
  Bottom 0.813: E13B.11 46.86,57.15 v46.86,76.2
D09  (via drill 0.81)
  Top 0.813: v46.86,31.75 44.32,34.29 44.32,99.06 34.16,109.22 34.16,171.45 J1.X
  Bottom 0.813: E13B.8 v46.86,31.75
D10  (via drill 0.81)
  Top 0.813: v41.78,76.2 41.78,99.06 32.89,108.58 32.89,168.91 J1.Z
  Bottom 0.813: E13B.5 15.11,40.64 15.11,48.26 17.65,50.16 32.89,50.16 35.43,53.34 35.43,76.83 36.7,78.74 40.51,78.74 v41.78,76.2
D11  (via drill 0.81)
  Top 0.813: v37.97,76.2 37.97,100.33 31.62,107.95 31.62,167.64 J1.BB
  Bottom 0.813: E13B.2 18.92,44.45 17.65,45.72 17.65,46.99 19.56,48.9 34.16,48.9 37.97,52.07 v37.97,76.2
DEVICE_FLAG
  Bottom 0.813: E9.5 88.77,39.37 E11.11 E11.2
GND  (via drill 0.81)
  Top 0.813: U$2.AT2 213.23,8.26 v213.23,24.13 v213.23,26.67 | U$2.AN2 225.93,8.26 225.93,20.32 228.47,22.86 244.98,22.86 | 244.98,22.86 251.33,22.86 C100.- 257.68,29.21 257.68,83.82 251.33,90.17 241.17,90.17 C2.2 236.09,85.09 E2.1 238.63,77.47 238.63,55.88 C1.2 238.63,50.8 238.63,34.29 E1.7 | U$2.AF2 244.98,8.26 244.98,22.86 | U$2.DF2 41.78,8.26 41.78,22.86 44.32,25.4 v51.94,25.4 | v51.94,25.4 v79.88,25.4 v79.88,22.86 79.88,8.26 U$2.CT2 | U$2.DC2 51.94,8.26 v51.94,25.4 | v92.58,25.4 v92.58,22.86 92.58,8.89 U$2.CN2 | U$2.CF2 111.63,8.26 v111.63,22.86 v111.63,25.4 | U$2.CC2 121.79,8.26 121.79,20.32 124.33,22.86 | 124.33,22.86 C102.- | 124.33,22.86 v131.95,22.86 v134.49,22.86 | U$2.BT2 143.38,8.26 v143.38,20.32 v143.38,22.86 | U$2.BN2 156.08,8.26 v156.08,20.32 v156.08,22.86 | U$2.BF2 175.13,8.89 175.13,21.59 181.48,26.67 185.29,26.67 | 185.29,26.67 C101.- v194.18,26.67 v194.18,24.13 | U$2.BC1 185.29,8.89 185.29,26.67 | E3.1 C3.2 | E5B.7 167.51,34.29 167.51,49.53 C5.2 E6.7 167.51,67.31 167.51,83.82 C6.2 | C8.2 130.68,83.82 130.68,67.31 E8.7 C7.2 131.95,52.07 133.22,50.8 133.22,36.83 E7.7 | J1.A J1.C J1.E J1.H J1.K J1.M J1.P J1.S J1.U J1.W J1.Y J1.AA J1.CC J1.EE J1.HH J1.KK J1.MM J1.PP J1.SS J1.UU 25.27,90.17 C14.2 E14.1 16.38,77.47 16.38,57.15 C13.2 22.73,49.53 22.73,34.29 E13B.7 | U$2.DT2 10.03,8.89 v10.03,22.86 v10.03,25.4 | U$2.DN2 22.73,8.89 v22.73,21.59 v22.73,24.13 | E11.7 58.29,34.29 58.29,49.53 C11.2 E12.7 58.29,67.31 58.29,83.82 C12.2 | v120.52,52.07 120.52,78.74 110.36,90.17 96.39,90.17 C10.2 96.39,82.55 96.39,64.77 E10.8 C9.2 93.85,52.07 96.39,49.53 96.39,35.56 E9.7
  Bottom 0.813: 213.23,8.89 213.23,8.26 U$2.AT2 213.23,8.89 | 213.23,8.89 v213.23,24.13 | v134.49,22.86 v143.38,22.86 | v156.08,22.86 v143.38,22.86 | U$2.BT2 143.38,8.89 v143.38,22.86 | U$2.BN2 156.08,8.89 v156.08,22.86 | U$2.BF2 175.13,8.89 175.13,22.86 | 175.13,22.86 v156.08,22.86 | U$2.BC1 185.29,10.16 185.29,22.86 | 185.29,22.86 175.13,22.86 | 185.29,22.86 C101.- 185.29,29.21 185.29,73.66 175.13,83.82 167.51,83.82 C6.2 139.57,86.36 137.03,83.82 130.68,83.82 C8.2 | v213.23,24.13 v194.18,24.13 v194.18,26.67 | v213.23,24.13 v213.23,26.67 225.93,26.67 | U$2.AC2 255.14,8.89 C100.- 244.98,26.67 | 244.98,26.67 225.93,26.67 | U$2.AF2 244.98,8.89 244.98,26.67 | U$2.AN2 225.93,10.16 225.93,26.67 | C2.2 234.82,88.9 203.07,88.9 C4.2 203.07,83.82 203.07,67.31 E4.7 C3.2 | U$2.DT2 10.03,10.16 v10.03,22.86 v10.03,25.4 15.11,25.4 16.38,24.13 v22.73,24.13 | U$2.DN2 22.73,8.89 v22.73,21.59 v22.73,24.13 | v22.73,24.13 34.16,24.13 35.43,25.4 41.78,25.4 | 41.78,25.4 v51.94,25.4 | U$2.DF2 41.78,8.89 41.78,25.4 | U$2.DC2 51.94,8.89 v51.94,25.4 | v51.94,25.4 v79.88,25.4 v92.58,25.4 | U$2.CT2 79.88,8.89 v79.88,22.86 | 92.58,8.26 92.58,8.89 | 92.58,8.89 v92.58,25.4 | U$2.CN2 92.58,8.89 | U$2.CF2 111.63,8.89 v111.63,25.4 | v111.63,25.4 v92.58,25.4 | v111.63,25.4 112.9,26.67 116.71,26.67 | 116.71,26.67 C102.- 120.52,15.24 121.48,14.29 U$2.CC2 | 116.71,26.67 116.71,48.26 v120.52,52.07 | C14.2 25.27,83.82 53.21,83.82 C12.2 58.29,83.82 90.04,83.82 C10.2
INITIALIZE  (via drill 0.81)
  Top 0.406: U$2.CR1 86.23,8.26
  Top 0.813: 86.23,8.26 v86.23,29.21 | v180.21,58.42 v190.37,58.42 | E2.5 E2.4
  Bottom 0.813: v86.23,29.21 100.2,29.21 104.01,33.02 104.01,46.99 115.44,58.42 v180.21,58.42 | v190.37,58.42 196.72,52.07 196.72,30.48 199.26,27.94 210.69,27.94 229.74,46.99 229.74,63.5 E2.5
INT_ENABLE
  Bottom 0.813: E9.6 67.18,34.29 E11.8 E11.5
IO_PAUSEH
  Top 0.813: E2.2 233.55,80.01 233.55,105.41 228.47,111.76 171.32,111.76 157.35,99.06 157.35,72.39 E6.6
IOT0L
  Bottom 0.813: E10.1 94.49,78.74 94.49,75.56 95.76,74.3 95.76,67.31 96.39,66.67 96.39,62.23 98.3,60.33 100.84,60.33 112.9,72.39 E8.4
IOT1L  (via drill 0.81)
  Top 0.813: v79.88,36.83 79.88,68.58 91.31,77.47 E10.2
  Bottom 0.813: E11.10 v79.88,36.83
IOT2L
  Bottom 0.813: E10.3 94.49,73.66 94.49,66.67 95.12,66.04 95.12,61.59 97.66,59.05 101.47,59.05 112.27,69.85 E8.5 E8.9
IOT3L  (via drill 0.81)
  Top 0.813: E2.11 E2.12 | v84.96,105.41 84.96,88.9 95.12,81.28 95.12,73.66 E10.4
  Bottom 0.813: v84.96,105.41 96.39,116.84 251.97,116.84 255.14,113.67 255.14,81.28 E2.12
IOT4L  (via drill 0.81)
  Top 0.813: E10.5 86.23,64.77 v86.23,58.42 | E8.2 E8.1
  Bottom 0.813: E12.13 65.91,74.93 65.91,72.39 | 65.91,72.39 65.91,69.85 | 65.91,69.85 E12.9 | E12.11 65.91,72.39 | 65.91,69.85 E10.5 | v86.23,58.42 90.04,54.61 102.74,54.61 110.36,60.96 135.13,60.96 138.3,63.5 138.3,71.12 E8.11 131.95,74.93 131.95,76.2 E8.2
IOTL
  Bottom 0.813: E12.1 57.02,82.55 93.85,82.55 95.76,80.64 95.76,77.47 97.03,76.2 97.03,72.39 E10.12 114.17,82.55 140.84,82.55 162.43,62.23 170.05,62.23 E6.8
MD03H  (1 unrouted)
  Top 0.813: E4.13 210.69,80.01 210.69,87.63
  Bottom 0.813: 210.69,96.52 243.71,96.52 248.79,91.44 248.79,85.09 E2.14
MD03L  (1 unrouted)
  Top 0.813: 211.96,90.17 211.96,77.47 E4.12 | 201.8,107.95 173.23,107.95 161.16,95.25 161.16,77.47 E6.3
MD04H
  Top 0.813: E3.14 210.69,49.53 210.69,54.61 204.98,60.96 204.98,69.85 E4.11 217.04,77.47
MD04L  (1 unrouted)
  Top 0.813: E4.10 222.12,76.2 | 210.69,109.22 172.59,109.22 159.89,96.52 159.89,76.2 E6.4
MD05H  (1 unrouted)
  Top 0.813: E3.13 211.96,46.99 211.96,55.88 206.25,62.23 206.25,65.41 | 218.31,110.49 171.96,110.49 158.62,97.79 158.62,73.66 E6.5
MD06H  (1 unrouted)
  Top 0.813: E3.2 197.99,46.99 197.99,55.88 203.71,60.96 203.71,72.39 | 182.75,105.41 175.13,105.41 170.05,100.33 170.05,91.44 174.5,87 174.5,76.83 E6.12
MD07H
  Top 0.813: E3.3 196.72,44.45 196.72,57.15 202.44,62.87 202.44,67.94 E4.5 180.21,80.01
MD07L  (1 unrouted)
  Top 0.813: 177.67,88.9 177.67,78.74 E4.6 | 171.96,98.42 171.96,92.08 175.77,88.27 175.77,74.93 E6.11
MD08H
  Top 0.813: E4.1 197.99,82.55 197.99,88.9
  Bottom 0.813: E14.13 24,73.66 24,64.77 21.46,62.23 16.38,62.23 12.57,66.04 12.57,90.17 17.65,96.52 44.32,96.52 46.86,99.06 60.83,99.06 63.37,96.52 105.28,96.52 109.09,92.71 171.32,92.71 175.13,88.9 178.94,88.9 189.1,80.01 E4.1
MD08L  (1 unrouted)
  Top 0.813: E4.2 195.45,80.01 | 192.91,106.68 173.86,106.68 162.43,94.61 162.43,81.92 E6.1 E6.2
MD09H
  Bottom 0.813: E10.13 98.3,73.66 98.3,77.47 97.66,78.11 97.66,82.55 102.11,85.09 102.11,88.27 97.66,92.71 59.56,92.71 57.02,95.25 49.4,95.25 46.86,92.71 21.46,92.71 17.65,87.63 17.65,85.09 25.27,80.01 E14.14
MD10H
  Bottom 0.813: E10.14 104.65,78.74 104.65,89.53 98.93,95.25 62.1,95.25 59.56,97.79 47.5,97.79 44.96,95.25 19.56,95.25 14.48,88.9 14.48,78.74 E14.3
MD11H
  Bottom 0.813: E10.15 103.38,80.01 103.38,88.9 98.3,93.98 60.83,93.98 58.29,96.52 48.13,96.52 45.59,93.98 20.19,93.98 16.38,88.9 16.38,80.01 E14.2
N$1  (via drill 0.81)
  Top 0.813: v194.18,39.37 182.12,39.37 176.4,34.29 E5B.9 | E1.9 241.17,36.83 241.17,39.37 E1.12 | v72.26,99.06 72.26,74.93 E12.10 | v143.38,41.91 145.92,44.45 145.92,96.52 v143.38,99.06
  Bottom 0.813: E1.9 247.52,31.75 247.52,30.48 246.25,29.21 243.71,29.21 238.63,34.29 E1.6 233.55,34.29 | E1.3 233.55,39.37 233.55,34.29 | 233.55,34.29 218.95,34.29 210.69,26.04 197.99,26.04 194.18,30.48 v194.18,39.37 | v143.38,99.06 109.09,99.06 106.55,101.6 74.8,101.6 v72.26,99.06 | v143.38,41.91 143.38,38.1 153.54,27.94 166.88,27.94 170.05,31.75 170.05,34.29 | 170.05,34.29 170.05,39.37 E5B.12 | E5B.9 170.05,34.29
N$2
  Bottom 0.813: W13.2 R1.1
N$3  (via drill 0.81)
  Top 0.813: v76.07,99.06 76.07,72.39 E12.8 63.37,60.96 67.18,57.15 v67.18,29.21 | v147.19,41.91 v147.19,99.06
  Bottom 0.813: E13B.3 24,41.91 | 24,41.91 E13B.12 | 24,34.29 E13B.9 48.13,34.29 53.21,29.21 v67.18,29.21 | E13B.6 24,34.29 | 24,34.29 24,41.91 | E5B.6 167.51,36.83 167.51,39.37 E5B.3 v147.19,41.91 | v147.19,99.06 143.38,95.25 109.09,95.25 106.55,99.06 v76.07,99.06
N$8
  Top 0.813: E11.4 51.94,41.91 51.94,69.85 E12.4
N$10  (via drill 0.81)
  Top 0.813: E9.3 E9.2 95.12,46.99 95.12,48.26 93.85,49.53 84.96,49.53 82.42,46.99 82.42,34.29 81.15,33.02 77.34,33.02 76.07,34.29 76.07,69.85 82.42,73.66 v82.42,105.41
  Bottom 0.813: v82.42,105.41 83.69,102.87 86.23,102.87 97.66,115.57 251.33,115.57 253.87,113.03 253.87,82.55 E2.13
N$13
  Bottom 0.813: E12.3 60.83,72.39 60.83,64.77 62.74,62.87 88.14,62.87 93.85,57.78 102.11,57.78 111.63,67.31 E8.6
N$24
  Top 0.813: E11.1 53.21,49.53 53.21,66.04 E12.6
N$26
  Bottom 0.813: E8.8 133.22,62.23 109.09,62.23 102.11,55.88 92.58,55.88 87.5,60.96 62.1,60.96 59.56,63.5 59.56,67.31 E12.5
N$196  (via drill 0.81)
  Top 0.813: E7.3 E7.2 130.05,46.35 130.05,48.26 129.41,48.9 126.87,48.9 119.25,41.91 112.9,41.91 v102.74,52.07
  Bottom 0.813: v102.74,52.07 100.84,50.16 90.04,50.16 81.15,59.69 57.02,59.69 53.21,63.5 53.21,76.2 E12.2
N$337
  Top 0.813: E7.6 E7.5 131.95,40.64 131.95,48.9 130.68,50.16 126.87,50.16 124.33,52.7 124.33,101.6 117.98,107.95 72.26,107.95 68.45,102.87 68.45,77.47 E12.12 | E7.8 E7.9
  Bottom 0.813: E7.6 E7.9
RD_RQST  (via drill 0.81)
  Top 0.813: v33.53,76.2 33.53,103.5 30.35,107.31 30.35,165.1 J1.DD | W13.1 v50.67,76.2
  Bottom 0.813: v33.53,76.2 36.07,80.01 48.13,80.01 v50.67,76.2 50.67,55.24 55.12,50.16 57.66,50.16 59.56,48.26 59.56,46.99 E11.13
VCC  (2 unrouted)
  Top 0.813: E1.14 C1.1 E2.8 241.17,67.31 241.17,83.82 243.71,86.36 C2.1 251.33,86.36 255.14,82.55 C100.+ | E5B.14 C5.1 170.05,54.61 170.05,77.47 E6.14 C6.1 | E7.14 C7.1 133.22,54.61 133.22,77.47 E8.14 C8.1 | E13B.14 C13.1 | C12.1 E12.14 60.83,77.47 60.83,54.61 C11.1 E11.14 | E9.14 C9.1 104.01,59.69 104.01,77.47 E10.16 C10.1 106.55,86.36 116.71,76.2 116.71,50.8 C102.+ | E14.8 25.27,67.31 25.27,85.09 C14.1
  Bottom 0.813: U$2.AA2 261.49,10.16 261.49,41.91 C100.+ | C4.1 208.15,83.82 | 208.15,83.82 E4.14 205.61,77.47 205.61,54.61 C3.1 205.61,49.53 205.61,34.29 E3.8 | C2.1 242.44,83.82 208.15,83.82 | U$2.BA2 191.32,8.57 191.64,8.89 191.64,43.18 C101.+ 187.83,73.66 175.13,86.36 C6.1 170.05,88.9 138.3,88.9 C8.1 | C13.1 E14.8 | U$2.CA2 128.14,7.62 128.14,20.32 125.6,22.86 125.6,43.18 C102.+ | C14.1 50.67,86.36 R1.2 60.83,88.9 C12.1 65.91,90.17 96.39,90.17 C10.1

### Text on the board
Top: SIDE 1 | CS*ABCDEFHJKLMNPRSTUVWXYZ | + | + | +
Bottom: 12 BIT WORD 6/E BUS INT. | M1703C | SIDE 2
200bmp: C:/Users/Vince/Documents/eagle/projects/DEC/Mxxx/M1703/M1703Cfrontb.bmp
201bmp: C:/Users/Vince/Documents/eagle/projects/DEC/Mxxx/M1703/M1703Cbackfb.bmp